# EAGLE design working (EAGLE 8.3.2)
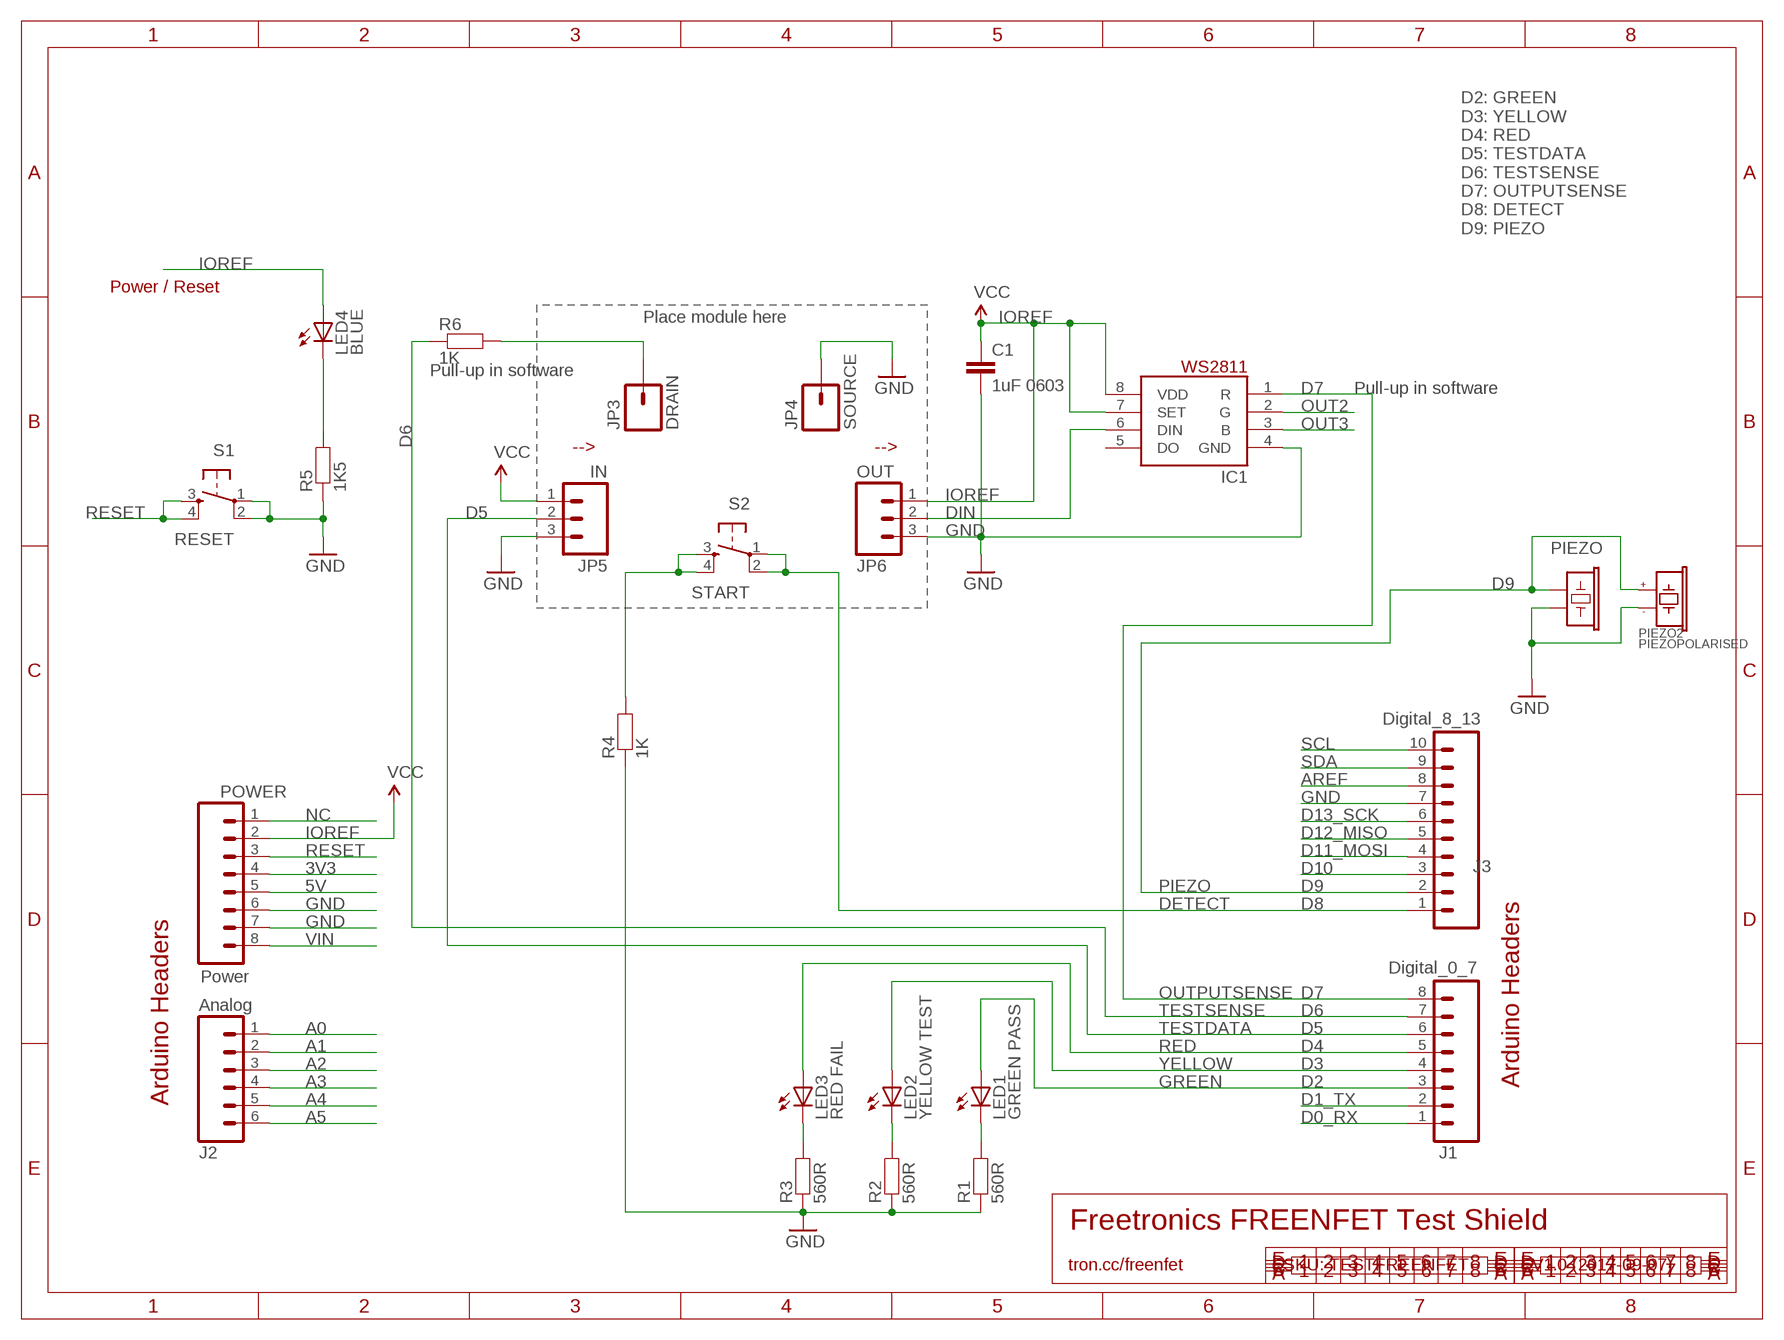
[diagram p0: schematic, sheet 1]

## Parts
C1  1uF 0603  CAP0603  [0603]
IC1  WS2811-SOP8  [SO08-SKINNYPADS]
J1  Digital_0_7  M08  [1X08]
J2  Analog  M06SIP  [1X06]
J3  Digital_8_13  M100.1  [1X10]
JP3  DRAIN  M012.1MM  [1X01_2_1_MM]
JP4  SOURCE  M012.1MM  [1X01_2_1_MM]
JP5  IN  M03PTH  [1X03]
JP6  OUT  M03PTH  [1X03]
LED1  GREEN PASS  LED0603  [LED-0603]
LED2  YELLOW TEST  LED0603  [LED-0603]
LED3  RED FAIL  LED0603  [LED-0603]
LED4  BLUE  LED0603  [LED-0603]
PIEZO  BUZZERSMD12X12  [BUZZER-12X12-SMT]
PIEZO2  PIEZOPOLARISED  [PIEZO12MMWIDEPOLARISED]
POWER  Power  M08  [1X08]
R1  560R  RESISTOR0603  [0603]
R2  560R  RESISTOR0603  [0603]
R3  560R  RESISTOR0603  [0603]
R4  1K  RESISTOR0603  [0603]
R5  1K5  RESISTOR0603  [0603]
R6  1K  RESISTOR0603  [0603]
S1  RESET  TAC_SWITCHPTH  [TACTILE-PTH]
S2  START  TAC_SWITCHPTH  [TACTILE-PTH]

## Nets
3V3: POWER.4
5V: POWER.5
A0: J2.1
A1: J2.2
A2: J2.3
A3: J2.4
A4: J2.5
A5: J2.6
AREF: J3.8
D0_RX: J1.1
D1_TX: J1.2
D2: J1.3 LED1.A
D3: J1.4 LED2.A
D4: J1.5 LED3.A
D5: J1.6 JP5.2
D6: J1.7 R6.1
D7: IC1.1(R) J1.8
D8: J3.1 S2.1 S2.2
D9: J3.2 PIEZO2.1(+) PIEZO.2
D10: J3.3
D11_MOSI: J3.4
D12_MISO: J3.5
D13_SCK: J3.6
DIN: IC1.6(DIN) JP6.2
GND: C1.2 IC1.4(GND) J3.7 JP4.1 JP5.3 JP6.3 PIEZO2.2(-) PIEZO.1 POWER.6 POWER.7 R1.1 R2.1 R3.1 R4.1 R5.1 S1.1 S1.2
IOREF: C1.1 IC1.7(SET) IC1.8(VDD) JP5.1 JP6.1 LED4.A POWER.2 ; supply symbol labelled VCC
N$1: LED1.C R1.2
N$2: LED2.C R2.2
N$3: LED3.C R3.2
N$4: LED4.C R5.2
N$5: JP3.1 R6.2
N$7: R4.2 S2.3 S2.4
NC: POWER.1
OUT2: IC1.2(G)
OUT3: IC1.3(B)
RESET: POWER.3 S1.3 S1.4
SCL: J3.10
SDA: J3.9
VIN: POWER.8
Unconnected: IC1.5(DO)

## Notes on the sheet
- D2: GREEN
  D3: YELLOW
  D4: RED
  D5: TESTDATA
  D6: TESTSENSE
  D7: OUTPUTSENSE
  D8: DETECT
  D9: PIEZO
- Power / Reset
- Place module here
- Pull-up in software
- Pull-up in software
- --> | -->
- PIEZO
- DETECT
- OUTPUTSENSE
- TESTSENSE
- TESTDATA
- RED
- YELLOW
- GREEN | Arduino Headers
- Arduino Headers
- Freetronics FREENFET Test Shield
- tron.cc/freenfet | SKU: TESTFREENFET | V1.0 (2017-09-07)

## Library data of the parts
C1 = freetronics-master-v1:CAP: Capacitor Standard 0603 ceramic capacitor, and 0.1" leaded capacitor.
IC1 = freetronics-jon:WS2811
J1 POWER = freetronics:M08: Header 8 Standard 8-pin 0.1" header. Use with straight break away headers (SKU : PRT-00116), right angle break away headers (PRT-00553), swiss pins (PRT-00743), machine pins (PRT-00117), and female headers (PRT-00115).
J2 = freetronics:M06: Header 6 Standard 6-pin 0.1" header. Use with straight break away headers (SKU : PRT-00116), right angle break away headers (PRT-00553), swiss pins (PRT-00743), machine pins (PRT-00117), and female headers (PRT-00115). Molex polarized connector foot print use with SKU : PRT-08094 with associated crimp pins and housings. NOTES ON THE VARIANTS LOCK and LOCK_LONGPADS... This footprint was designed to help hold the alignment of a through-hole component (i.e. 6-pin header) while soldering it into place. You may notice that each hole has been shifted either up or down by 0.005 of an inch from it's more standard position (which is a perfectly straight line). This slight alteration caused the pins (the squares in the middle) to touch the edges of the holes. Because they are alternating, it causes a "brace" to hold the component in place. 0.005 has proven to be the perfect amount of "off-center" position when using our standard breakaway headers. Although looks a little odd when you look at the bare footprint, once you have a header in there, the alteration is very hard to notice. Also, if you push a header all the way into place, it is covered up entirely on the bottom side. This idea of altering the position of holes to aid alignment will be further integrated into the Sparkfun Library for other footprints. It can help hold any component with 3 or more connection pins.
J3 = freetronics-original:M10: Header 10 Standard 10-pin 0.1" header. Use with straight break away headers (SKU : PRT-00116), right angle break away headers (PRT-00553), swiss pins (PRT-00743), machine pins (PRT-00117), and female headers (PRT-00115).
JP3 JP4 = freetronics-jon:M01: Header 1 Standard 1-pin 0.1" header. Use with straight break away headers (SKU : PRT-00116), right angle break away headers (PRT-00553), swiss pins (PRT-00743), machine pins (PRT-00117), and female headers (PRT-00115).
JP5 JP6 = freetronics-jon:M03: Header 3 Standard 3-pin 0.1" header. Use with straight break away headers (SKU : PRT-00116), right angle break away headers (PRT-00553), swiss pins (PRT-00743), machine pins (PRT-00117), and female headers (PRT-00115). Molex polarized connector foot print use with SKU : PRT-08232 with associated crimp pins and housings.
LED1-LED4 = freetronics-jon:LED: LEDs Standard schematic elements and footprints for 5mm, 3mm, 1206, and 0603 sized LEDs. 5mm - Spark Fun Electronics SKU : COM-00529 (and others)
PIEZO = freetronics-master-v1:BUZZER: Buzzer - Piezo Transducer
PIEZO2 = freetronics-jon:PIEZOPOLARISED
R1-R6 = freetronics-jon:RESISTOR: Resistor Basic schematic elements and footprints for 0603, 1206, and PTH 1/10th watt (small) resistors.
S1 S2 = freetronics:TAC_SWITCH: Momentary Switch Button commonly used for reset or general input. Spark Fun Electronics SKU : COM-00097

## Board
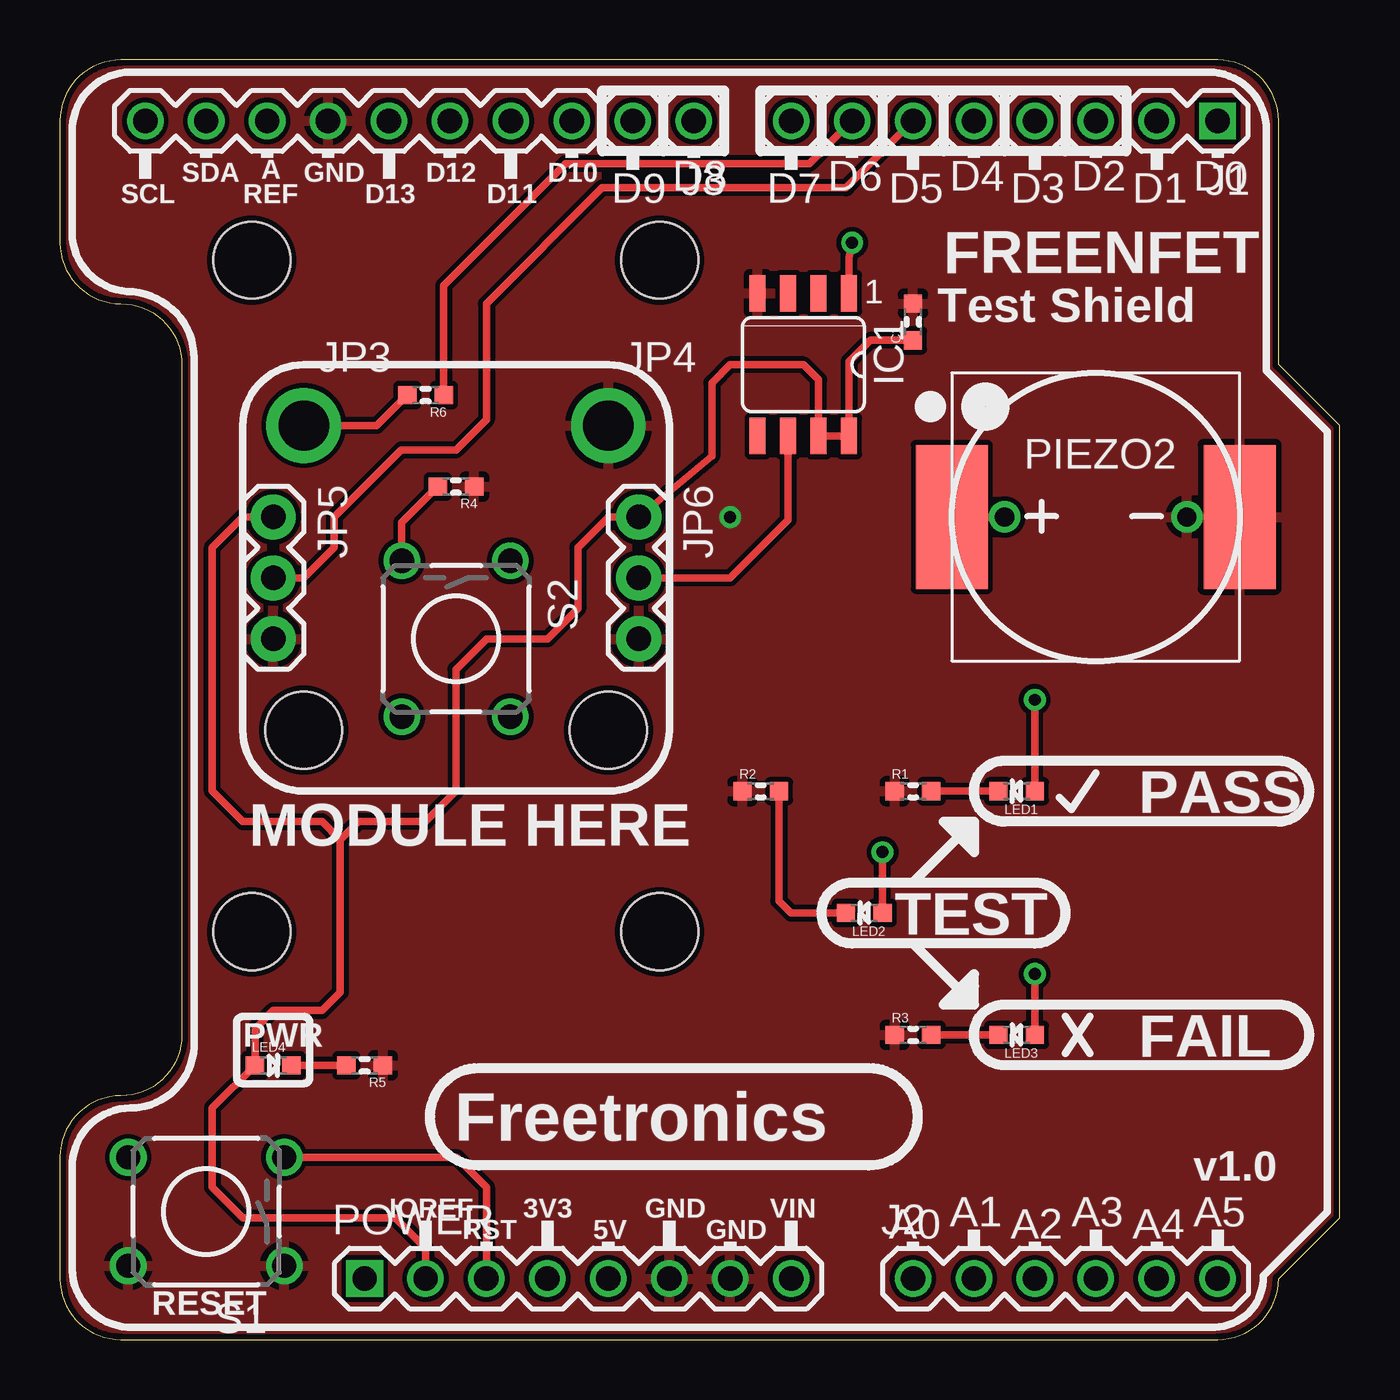
[diagram p1: board, top side]
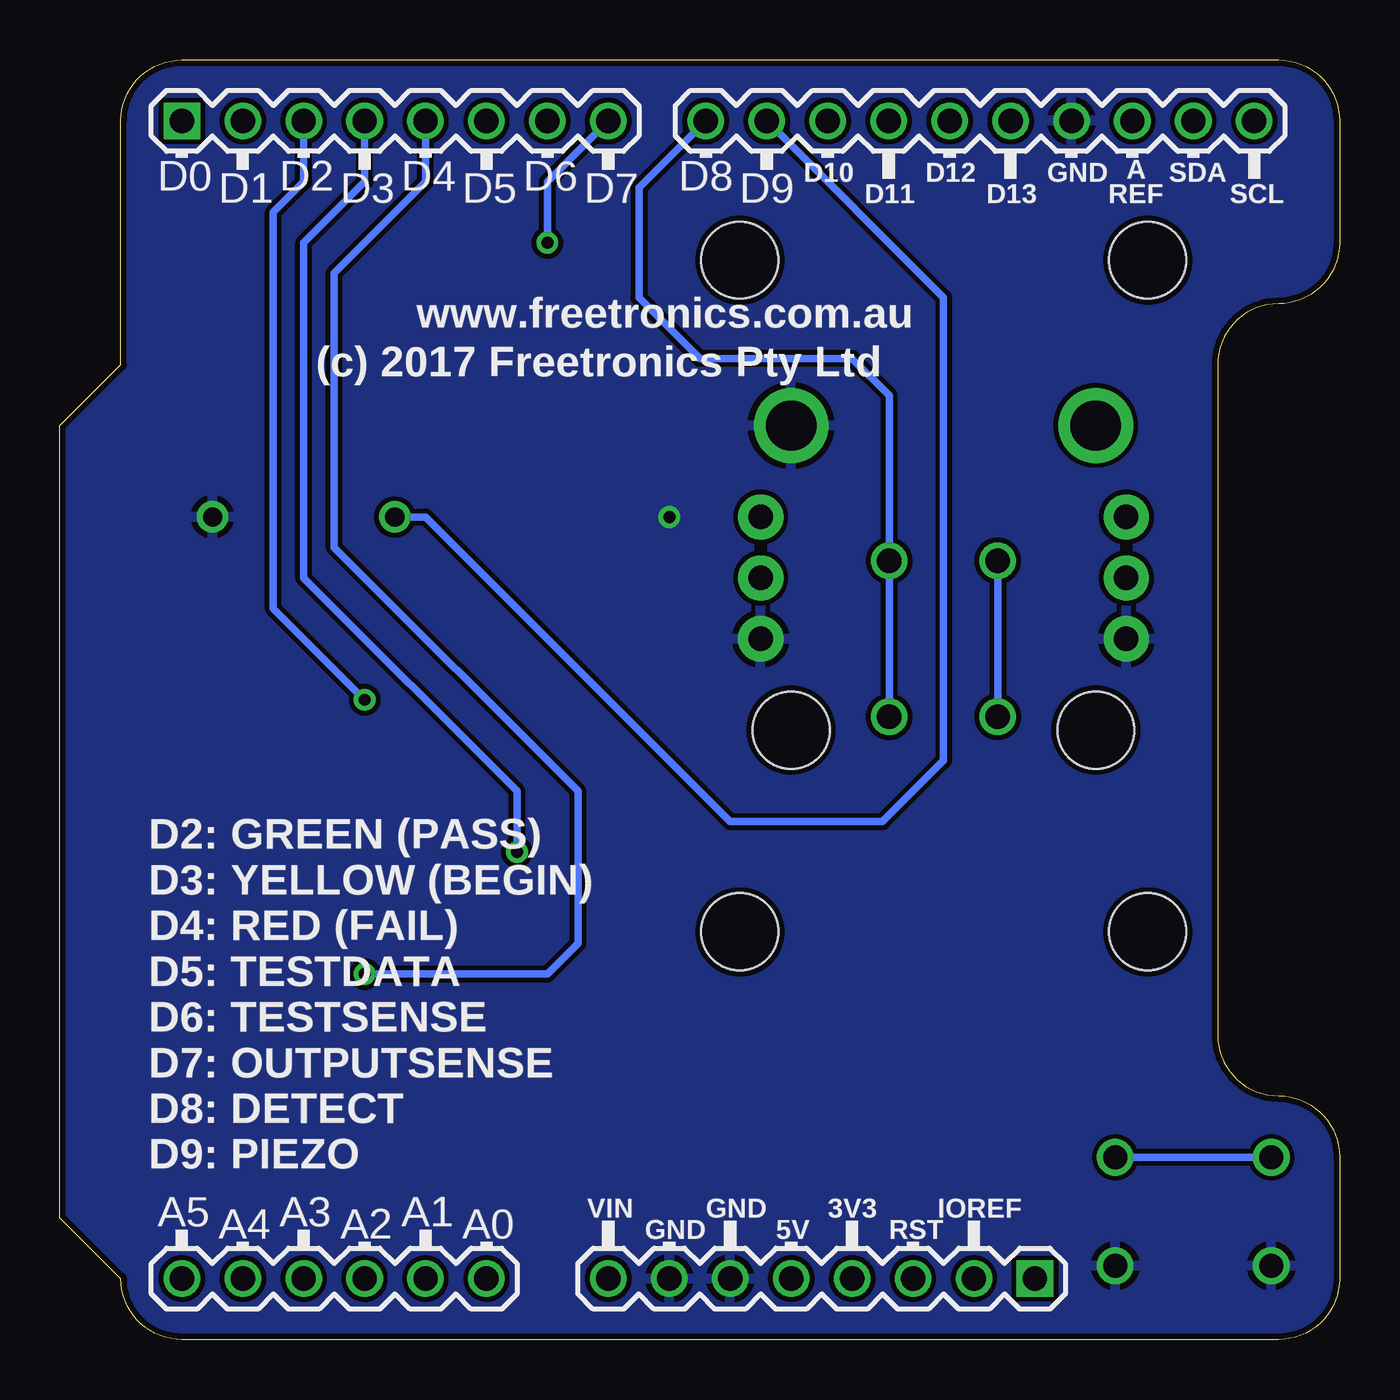
[diagram p2: board, bottom side, seen from below]

Size 53.34 x 53.34 mm. Coordinates in mm from the lower left corner, seen from the top.
Outline: 0,2.54 arc90 2.54,0 48.26,0 arc90 50.8,2.54 53.34,5.08 53.34,38.1 50.8,40.64 50.8,50.8 arc90 48.26,53.34 2.54,53.34 arc90 0,50.8 0,45.72 arc90 2.54,43.18 arc-90 5.08,40.64 5.08,12.7 arc-90 2.54,10.16 arc90 0,7.62 0,2.54
Copper layers (1*16): Top 0.035mm / dielectric 1.5mm / Bottom 0.035mm
Design rules "dirt_cheap_dirty_boards.v1 *": minimum track width 5mil, minimum drill 12mil, track to track 8mil, track to pad 8mil, pad to pad 8mil, via to via 8mil, smd to smd 0mil, copper to edge 10mil, drill to drill 10mil, minimum pad ring 10mil, minimum via ring 8mil, stop-mask expansion 2mil, vias tented up to drill 25mil, thermal gap 10mil
Holes 3.2 mm at 10.16,25.4 22.86,25.4 8,17 25,17 25,45 8,45

### Footprints (pad centres in the part's own frame; a part is rotated, then mirrored left to right if it is on the bottom)
0603 = smd 0.762 x 0.762: 1 -0.762,0; 2 0.762,0
SO08-SKINNYPADS = smd 0.66 x 1.524: 1 -1.905,-2.973; 2 -0.635,-2.973; 3 0.635,-2.973; 4 1.905,-2.973; 5 1.905,2.973; 6 0.635,2.973; 7 -0.635,2.973; 8 -1.905,2.973
1X08 = drill 1.016 square: 1 0,0 | drill 1.016: 2 2.54,0; 3 5.08,0; 4 7.62,0; 5 10.16,0; 6 12.7,0; 7 15.24,0; 8 17.78,0
1X06 = drill 1.016: 1 0,0; 2 2.54,0; 3 5.08,0; 4 7.62,0; 5 10.16,0; 6 12.7,0
1X10 = drill 1.016: 1 0,0; 2 2.54,0; 3 5.08,0; 4 7.62,0; 5 10.16,0; 6 12.7,0; 7 15.24,0; 8 17.78,0; 9 20.32,0; 10 22.86,0
1X01_2_1_MM = drill 2.1: 1 0,0
1X03 = drill 1.016 pad 1.88: 1 0,0; 2 2.54,0; 3 5.08,0
LED-0603 = smd 0.762 x 0.762: A -0.762,0; C 0.762,0
BUZZER-12X12-SMT = smd 3 x 6: 1 -6,0; 2 6,0
PIEZO12MMWIDEPOLARISED = drill 0.8: 1 -3.8,0; 2 3.8,0
TACTILE-PTH = drill 1.016: 1 -3.251,2.261; 2 3.251,2.261; 3 -3.251,-2.261; 4 3.251,-2.261

### Placement (x,y rotation side)
C1  35.56,42.42 90 top
IC1  30.99,40.64 180 top
J1  48.26,50.8 180 top
J2  35.56,2.54 0 top
J3  26.42,50.8 180 top
JP3  10.16,38.1 0 top
JP4  22.86,38.1 0 top
JP5  8.89,34.29 270 top
JP6  24.13,34.29 270 top
LED1  39.88,22.86 180 top
LED2  33.53,17.78 180 top
LED3  39.88,12.7 180 top
LED4  8.89,11.43 0 top
PIEZO  43.18,34.29 180 top
PIEZO2  43.18,34.29 0 top
POWER  12.7,2.54 0 top
R1  35.56,22.86 0 top
R2  29.21,22.86 0 top
R3  35.56,12.7 0 top
R4  16.51,35.56 180 top
R5  12.7,11.43 180 top
R6  15.24,39.37 180 top
S1  6.1,5.33 180 top
S2  16.51,29.21 270 top

### Tracks (layer width: path | path; a pad name or v marks a point on that pad's centre or on a via)
D2  (via drill 0.5)
  Top 0.305: LED1.A v40.64,26.67
  Bottom 0.305: v40.64,26.67 44.45,30.48 44.45,46.99 43.18,48.26 J1.3
D3  (via drill 0.5)
  Top 0.305: LED2.A v34.29,20.32
  Bottom 0.305: v34.29,20.32 34.29,22.86 43.18,31.75 43.18,45.72 40.64,48.26 J1.4
D4  (via drill 0.5)
  Top 0.305: LED3.A v40.64,15.24
  Bottom 0.305: v40.64,15.24 33.02,15.24 31.75,16.51 31.75,22.86 41.91,33.02 41.91,44.45 38.1,48.26 J1.5
D5
  Top 0.305: J1.6 32.77,48.01 22.61,48.01 17.78,43.18 17.78,38.35 16.51,37.08 14.22,37.08 11.43,34.29 11.43,33.02 10.16,31.75 JP5.2
D6
  Top 0.305: J1.7 31.24,49.02 21.08,49.02 16,43.94 R6.1
D7  (via drill 0.5)
  Top 0.305: IC1.1 32.89,45.09 v33.02,45.72
  Bottom 0.305: v33.02,45.72 33.02,48.26 J1.8
D8
  Bottom 0.305: S2.2 S2.1 18.77,39.34 20.32,40.89 26.67,40.89 29.21,43.43 29.21,48.01 J3.1
D9
  Top 0.305: PIEZO2.1 PIEZO.2
  Bottom 0.305: PIEZO2.1 38.1,34.29 25.4,21.59 19.05,21.59 16.51,24.13 16.51,43.43 J3.2
DIN
  Top 0.305: IC1.6 30.35,34.16 27.94,31.75 JP6.2
GND  (via drill 0.5)
  other vias: 27.94,34.29
  pour Bottom: 0,50.8 arc-74 2.54,53.34 48.26,53.34 arc-74 50.8,50.8 50.8,40.64 53.34,38.1 53.34,5.08 50.8,2.54 arc-74 48.26,0 2.54,0 arc-74 0,2.54 0,7.62 arc-90 2.54,10.16 arc90 5.08,12.7 5.08,40.64 arc90 2.54,43.18 arc-90 0,45.72
  pour Top: 0,50.8 arc-74 2.54,53.34 48.26,53.34 arc-74 50.8,50.8 50.8,40.64 53.34,38.1 53.34,5.08 50.8,2.54 arc-74 48.26,0 2.54,0 arc-74 0,2.54 0,7.62 arc-90 2.54,10.16 arc90 5.08,12.7 5.08,40.64 arc90 2.54,43.18 arc-90 0,45.72
IOREF
  Top 0.305: POWER.2 15.24,3.81 13.97,5.08 7.62,5.08 6.35,6.35 6.35,9.65 LED4.A 8.13,12.95 8.89,13.72 10.92,13.72 11.68,14.48 11.68,20.83 | C1.1 33.78,41.66 32.89,40.77 IC1.8 IC1.7 31.62,40.01 30.99,40.64 27.94,40.64 27.18,39.88 27.18,36.83 JP6.1 22.86,34.29 21.59,33.02 21.59,30.48 20.32,29.21 17.78,29.21 16.51,27.94 16.51,22.86 15.24,21.59 12.45,21.59 11.68,20.83 | JP5.1 7.62,34.29 6.35,33.02 6.35,22.86 7.62,21.59 10.92,21.59 11.68,20.83
N$1
  Top 0.305: R1.2 LED1.C
N$2
  Top 0.305: R2.2 29.97,18.29 30.48,17.78 LED2.C
N$3
  Top 0.305: R3.2 LED3.C
N$4
  Top 0.305: R5.2 LED4.C
N$5
  Top 0.305: R6.2 13.21,38.1 JP3.1
N$7
  Top 0.305: R4.2 14.25,34.06 S2.3
  Bottom 0.305: S2.3 S2.4
RESET
  Top 0.305: POWER.3 17.78,6.35 16.54,7.59 S1.3
  Bottom 0.305: S1.4 S1.3
  Bottom 0.61: S1.3 9.37,7.59

### Text on the board
tPlace: SDA | A | GND | D12 | D10 | D8 | D6 | D4 | D2 | D0 | SCL | REF | D13 | D11 | D9 | D7 | D5 | D3 | D1 | FREENFET | 1 | Test Shield | PASS | MODULE HERE | TEST | PWR | FAIL | Freetronics | v1.0 | IOREF | 3V3 | GND | VIN | A1 | A3 | A5 | RST | 5V | GND | A0 | A2 | A4 | RESET
bPlace: SDA | A | GND | D12 | D10 | D8 | D6 | D4 | D2 | D0 | SCL | REF | D13 | D11 | D9 | D7 | D5 | D3 | D1 | www.freetronics.com.au | (c) 2017 Freetronics Pty Ltd | D2: GREEN (PASS) / D3: YELLOW (BEGIN) / D4: RED (FAIL) / D5: TESTDATA / D6: TESTSENSE / D7: OUTPUTSENSE / D8: DETECT / D9: PIEZO | IOREF | 3V3 | GND | VIN | A1 | A3 | A5 | RST | 5V | GND | A0 | A2 | A4
tDocu: K | A | K | A | K | A